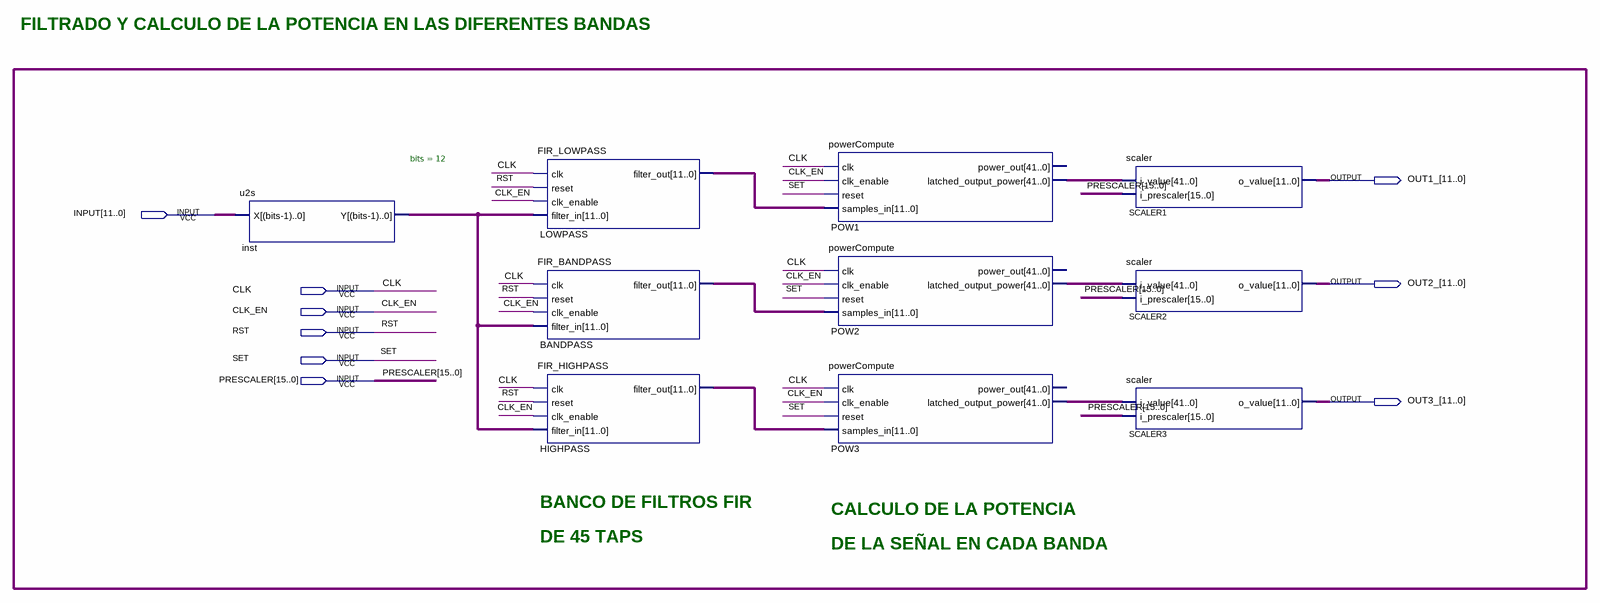
[diagram p0: schematic sheet]
// Quartus schematic FILT.bdf as structural Verilog: 10 symbols, 9 pins
module FILT (
  input  [11:0] INPUT,
  input  CLK,
  input  CLK_EN,
  input  RST,
  input  SET,
  input  [15:0] PRESCALER,
  output [11:0] OUT1_,
  output [11:0] OUT2_,
  output [11:0] OUT3_
);

  wire [11:0] BANDPASS_filter_out, HIGHPASS_filter_out, inst_y, LOWPASS_filter_out;
  wire [41:0] POW1_latched_output_power, POW2_latched_output_power, POW3_latched_output_power;

  u2s #(.bits(12)) inst (.X(INPUT), .Y(inst_y));
  FIR_LOWPASS LOWPASS (
    .clk(CLK), .reset(RST), .clk_enable(CLK_EN), .filter_in(inst_y), .filter_out(LOWPASS_filter_out));
  FIR_BANDPASS BANDPASS (
    .clk(CLK), .reset(RST), .clk_enable(CLK_EN), .filter_in(inst_y), .filter_out(BANDPASS_filter_out));
  FIR_HIGHPASS HIGHPASS (
    .clk(CLK), .reset(RST), .clk_enable(CLK_EN), .filter_in(inst_y), .filter_out(HIGHPASS_filter_out));
  powerCompute POW1 (
    .clk(CLK), .clk_enable(CLK_EN), .reset(SET), .samples_in(LOWPASS_filter_out),
    .latched_output_power(POW1_latched_output_power));  // open: power_out
  powerCompute POW2 (
    .clk(CLK), .clk_enable(CLK_EN), .reset(SET), .samples_in(BANDPASS_filter_out),
    .latched_output_power(POW2_latched_output_power));  // open: power_out
  powerCompute POW3 (
    .clk(CLK), .clk_enable(CLK_EN), .reset(SET), .samples_in(HIGHPASS_filter_out),
    .latched_output_power(POW3_latched_output_power));  // open: power_out
  scaler SCALER1 (.i_value(POW1_latched_output_power), .i_prescaler(PRESCALER), .o_value(OUT1_));
  scaler SCALER2 (.i_value(POW2_latched_output_power), .i_prescaler(PRESCALER), .o_value(OUT2_));
  scaler SCALER3 (.i_value(POW3_latched_output_power), .i_prescaler(PRESCALER), .o_value(OUT3_));

  // Notes on the sheet:
  //   FILTRADO Y CALCULO DE LA POTENCIA EN LAS DIFERENTES BANDAS
  //   BANCO DE FILTROS FIR
  //   CALCULO DE LA POTENCIA
  //   DE 45 TAPS
  //   DE LA SEÑAL EN CADA BANDA
endmodule
